# Altium project infant_temperature_1.PrjPcb
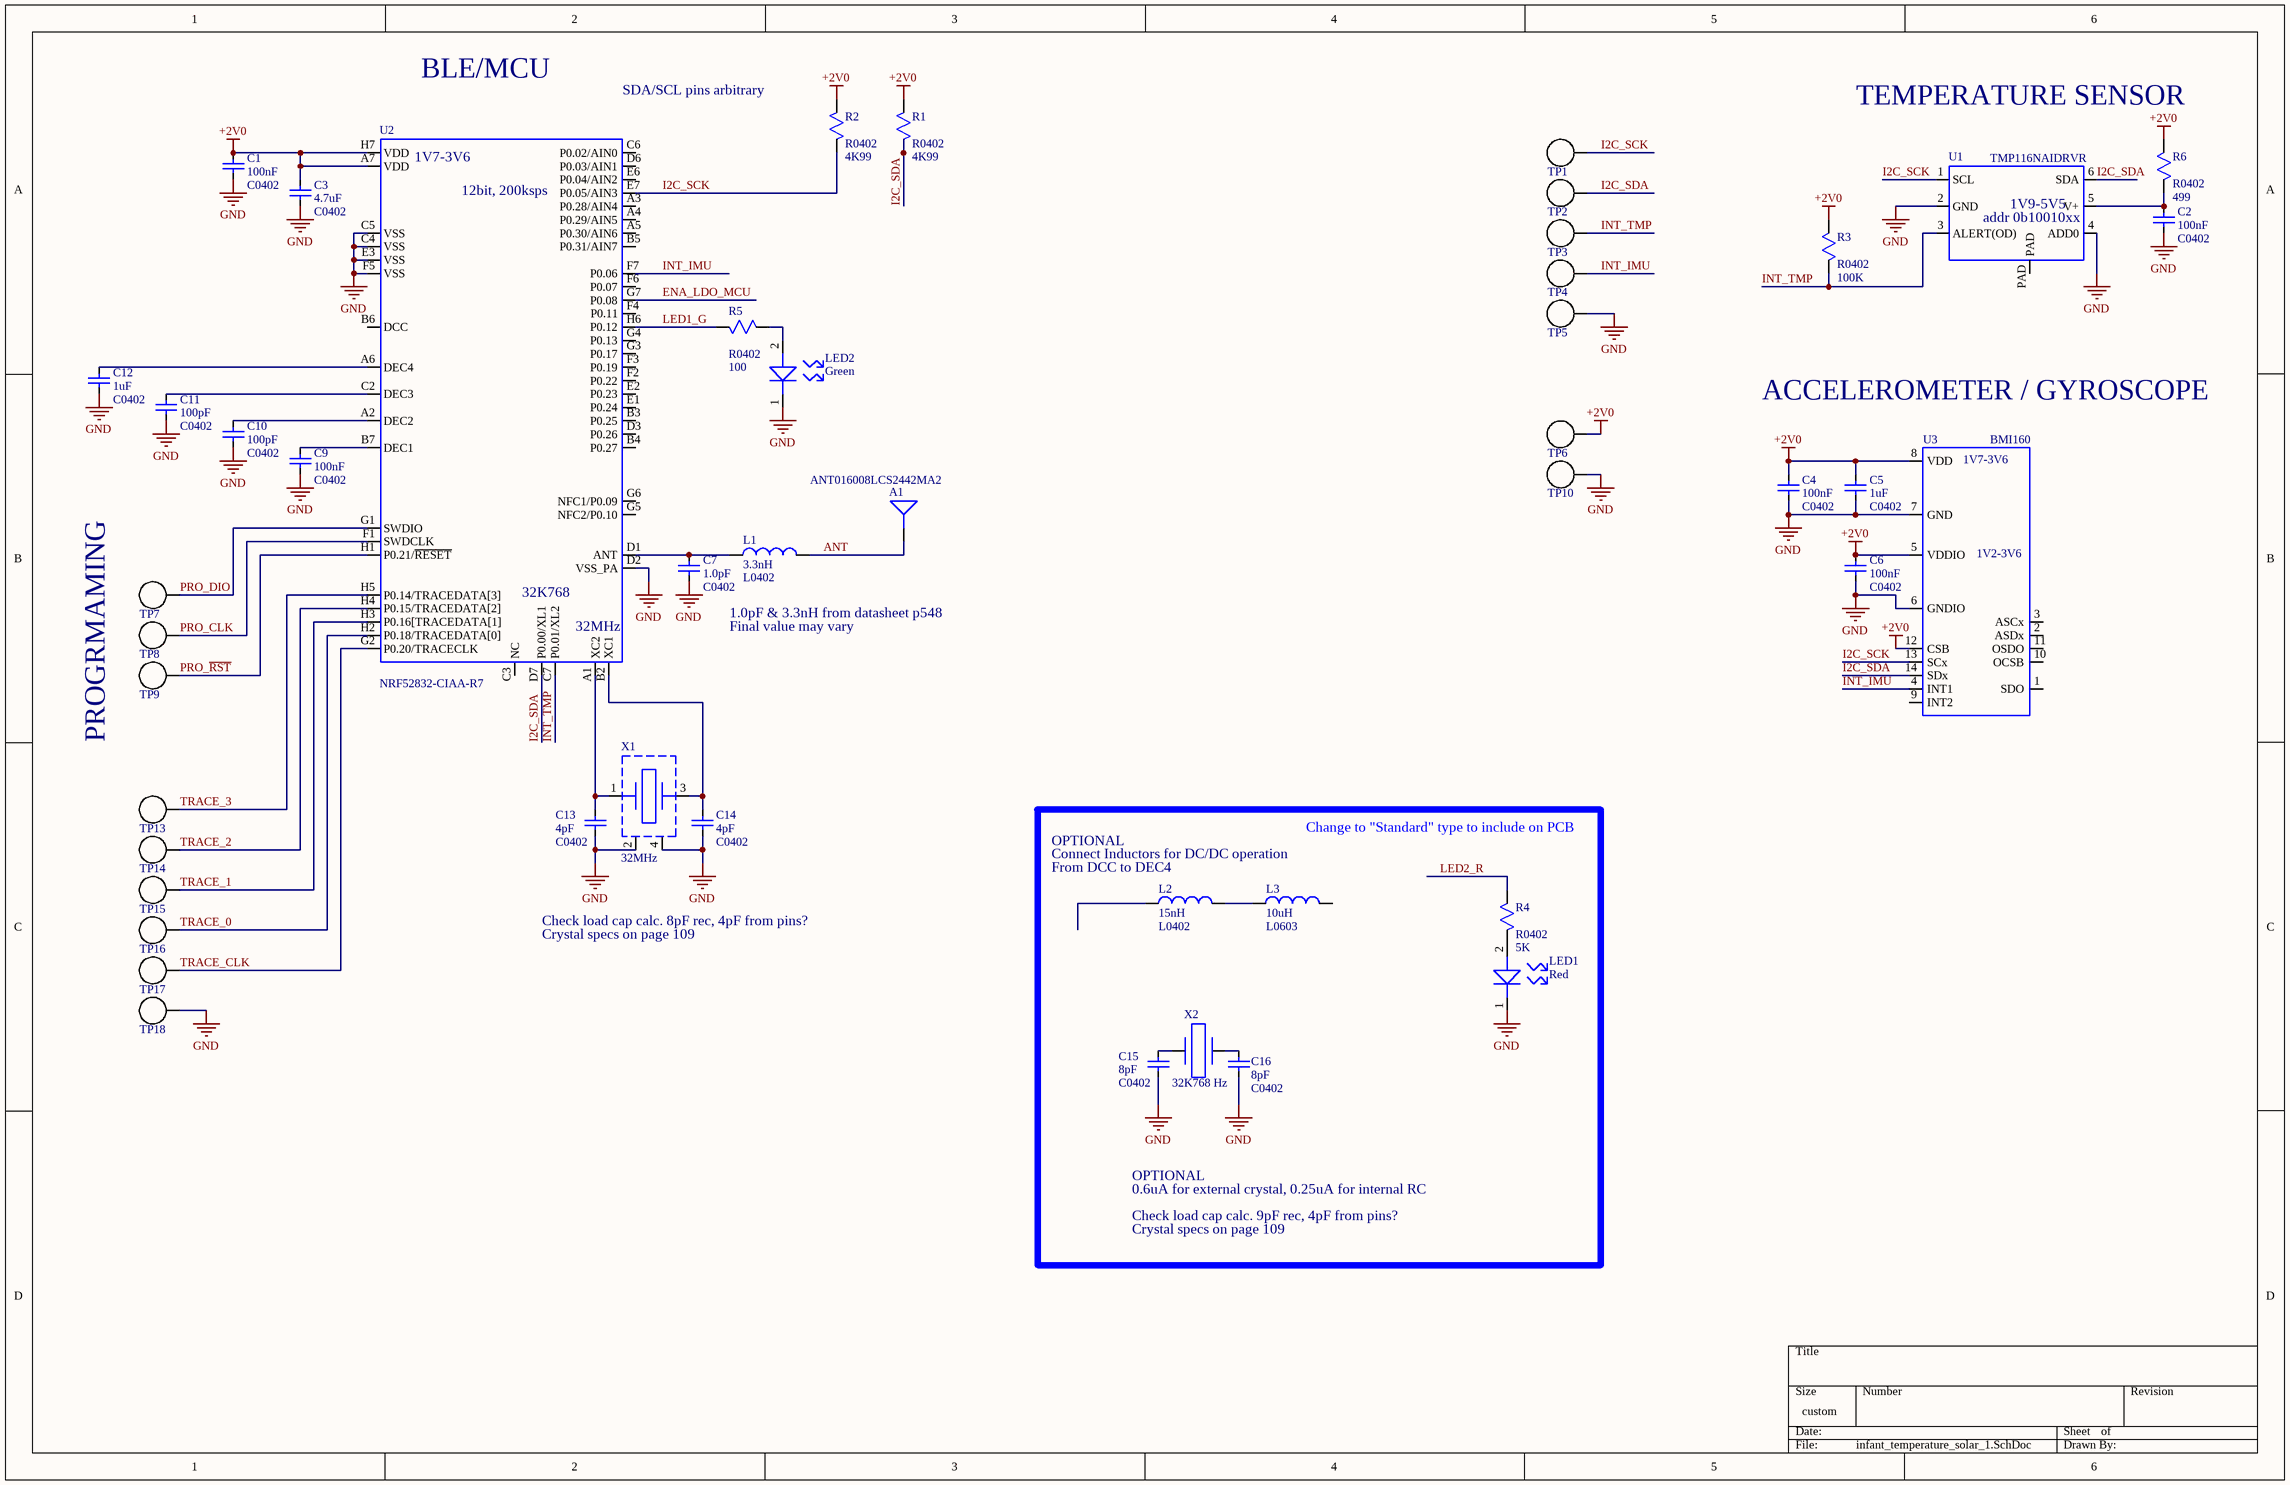
[diagram p0: infant_temperature_solar_1.SchDoc]
2 sheets, 81 parts. Net scope: global (net labels, ports and power ports of the same name join across sheets).
Board file: infant_temperature_1_solar.PcbDoc
Sheets:
  infant_temperature_solar_1.SchDoc
  infant_temperature_solar_power_1.SchDoc

## Sheet infant_temperature_solar_1.SchDoc
size 431 x 279 mm

### Parts
(Parts that share a designator on the sheet are numbered #1, #2 ... from top to bottom, then left to right.)
A1  ANT016008LCS2442MA2  [ANT016008LCS]
C1  100nF  [C0402]
C2  100nF  [C0402]
C3  4.7uF  [C0402]
C4  100nF  [C0402]
C5  1uF  [C0402]
C6  100nF  [C0402]
C7  1.0pF  [C0402]
C9  100nF  [C0402]
C10  100pF  [C0402]
C11  100pF  [C0402]
C12  1uF  [C0402]
C13  4pF  [C0402]
C14  4pF  [C0402]
C15  8pF  [C0402]  (graphical)
C16  8pF  [C0402]  (graphical)
L1  value 3.3nH  [L0402]  (hidden comment: IND)
L2  value 15nH  [L0402]  (hidden comment: IND)  (graphical)
L3  value 10uH  [L0603]  (hidden comment: IND)  (graphical)
LED1  Red  [LED_0402]  (graphical)
LED2  Green  [LED_0402]
R1  value 4K99  [R0402]  (hidden comment: Resistor)
R2  value 4K99  [R0402]  (hidden comment: Resistor)
R3  value 100K  [R0402]  (hidden comment: Resistor)
R4#1  value 5K  [R0402]  (hidden comment: Resistor)  (graphical)
R5  value 100  [R0402]  (hidden comment: Resistor)
R6  value 499  [R0402]  (hidden comment: Resistor)
TP1  Not A Part  [TP_32AWG_1X0.5MM_ROUND]  (value not drawn)  (no BOM)
TP2  Not A Part  [TP_32AWG_1X0.5MM_ROUND]  (value not drawn)  (no BOM)
TP3  Not A Part  [TP_32AWG_1X0.5MM_ROUND]  (value not drawn)  (no BOM)
TP4  Not A Part  [TP_32AWG_1X0.5MM_ROUND]  (value not drawn)  (no BOM)
TP5  Not A Part  [TP_32AWG_1X0.5MM_ROUND]  (value not drawn)  (no BOM)
TP6  Not A Part  [TP_32AWG_1X0.5MM_ROUND]  (value not drawn)  (no BOM)
TP7  Not A Part  [TP_32AWG_1X0.5MM_ROUND]  (value not drawn)  (no BOM)
TP8  Not A Part  [TP_32AWG_1X0.5MM_ROUND]  (value not drawn)  (no BOM)
TP9  Not A Part  [TP_32AWG_1X0.5MM_ROUND]  (value not drawn)  (no BOM)
TP10  Not A Part  [TP_32AWG_1X0.5MM_ROUND]  (value not drawn)  (no BOM)
TP13  Not A Part  [TP_32AWG_1X0.5MM_ROUND]  (value not drawn)  (no BOM)
TP14  Not A Part  [TP_32AWG_1X0.5MM_ROUND]  (value not drawn)  (no BOM)
TP15  Not A Part  [TP_32AWG_1X0.5MM_ROUND]  (value not drawn)  (no BOM)
TP16  Not A Part  [TP_32AWG_1X0.5MM_ROUND]  (value not drawn)  (no BOM)
TP17  Not A Part  [TP_32AWG_1X0.5MM_ROUND]  (value not drawn)  (no BOM)
TP18  Not A Part  [TP_32AWG_1X0.5MM_ROUND]  (value not drawn)  (no BOM)
U1  MfgPartNumber: TMP116NAIDRVR  [WSON-6_PAD]  (hidden comment: TMP116)
U2  MfgPartNumber: NRF52832-CIAA-R7  [XFBGA-50]  (hidden comment: NRF52832_BGA)
U3  MfgPartNumber: BMI160  [LGA-14]  (hidden comment: BMI160_ALTERNATE)
X1  32MHz  [CRYSTAL_1MM6_X_1MM2]
X2  32K768 Hz  [CRYSTAL_1MM2_X_1MM0]  (graphical)

### Nets
+2V0: C1.1 C3.1 C4.1 C5.1 C6.1 R1.1 R2.1 R3.1 R6.1 TP6.1(MTG) U2.A7(VDD) U2.H7(VDD) U3.5(VDDIO) U3.8(VDD) U3.12(CSB)
GND: C1.2 C2.2 C3.2 C4.2 C5.2 C6.2 C7.2 C9.2 C10.2 C11.2 C12.2 C13.1 C14.1 C15.1 C16.1 LED1.1 LED2.1 TP5.1(MTG) TP10.1(MTG) TP18.1(MTG) U1.2(GND) U1.4(ADD0) U2.C4(VSS) U2.C5(VSS) U2.D2(VSS_PA) U2.E3(VSS) U2.F5(VSS) U3.6(GNDIO) U3.7(GND) X1.2(GND) X1.4(GND)
ANT: A1.4(FEED) L1.2
ENA_LDO_MCU: U2.G7(P0.08)
I2C_SCK: R2.2 TP1.1(MTG) U1.1(SCL) U2.E7(P0.05/AIN3) U3.13(SCx)
I2C_SDA: R1.2 TP2.1(MTG) U1.6(SDA) U2.D7(P0.00/XL1) U3.14(SDx)
INT_IMU: TP4.1(MTG) U2.F7(P0.06) U3.4(INT1)
INT_TMP: R3.2 TP3.1(MTG) U1.3(ALERT(OD)) U2.C7(P0.01/XL2)
LED1_G: R5.1 U2.H6(P0.12)
LED2_R: R4#1.1
PRO_CLK: TP8.1(MTG) U2.F1(SWDCLK)
PRO_DIO: TP7.1(MTG) U2.G1(SWDIO)
PRO_~{RST}: TP9.1(MTG) U2.H1(P0.21/~{RESET})
TRACE_0: TP16.1(MTG) U2.H2(P0.18/TRACEDATA[0])
TRACE_1: TP15.1(MTG) U2.H3(P0.16[TRACEDATA[1])
TRACE_2: TP14.1(MTG) U2.H4(P0.15/TRACEDATA[2])
TRACE_3: TP13.1(MTG) U2.H5(P0.14/TRACEDATA[3])
TRACE_CLK: TP17.1(MTG) U2.G2(P0.20/TRACECLK)
NetC2_1: C2.1 R6.2 U1.5(V+)
NetC7_1: C7.1 L1.1 U2.D1(ANT)
NetC9_1: C9.1 U2.B7(DEC1)
NetC10_1: C10.1 U2.A2(DEC2)
NetC11_1: C11.1 U2.C2(DEC3)
NetC12_1: C12.1 U2.A6(DEC4)
NetC13_2: C13.2 U2.A1(XC2) X1.1
NetC14_2: C14.2 U2.B2(XC1) X1.3
NetC15_2: C15.2 X2.2
NetC16_2: C16.2 X2.1
NetL2_2: L2.2 L3.1
NetLED1_2: LED1.2 R4#1.2
NetLED2_2: LED2.2 R5.2

Not connected (* = marked no-connect by the designer): L2 1; L3 2; U1 PAD; U2 A3(P0.28/AIN4) A4(P0.29/AIN5) A5(P0.30/AIN6) B3(P0.25) B4(P0.27) B5(P0.31/AIN7) B6(DCC) C3(NC) C6(P0.02/AIN0) D3(P0.26) D6(P0.03/AIN1) E1(P0.24) E2(P0.23) E6(P0.04/AIN2) F2(P0.22) F3(P0.19) F4(P0.11) F6(P0.07) G3(P0.17) G4(P0.13) G5(NFC2/P0.10) G6(NFC1/P0.09); U3 1(SDO) 2(ASDx) 3(ASCx) 9(INT2) 10(OCSB) 11(OSDO)

### Notes on the sheet
- BLE/MCU
- SDA/SCL pins arbitrary
- TEMPERATURE SENSOR
- ACCELEROMETER / GYROSCOPE
- 1.0pF & 3.3nH from datasheet p548
- Final value may vary
- PROGRMAMING
- Change to "Standard" type to include on PCB
- Connect Inductors for DC/DC operation
- OPTIONAL
- (near L2) From DCC to DEC4
- Crystal specs on page 109
- Check load cap calc. 8pF rec, 4pF from pins?
- Check load cap calc. 9pF rec, 4pF from pins?
- 0.6uA for external crystal, 0.25uA for internal RC
- (in symbol BMI160_ALTERNATE) 1V7-3V6; 1V2-3V6
- (in symbol NRF52832_BGA) 1V7-3V6; 12bit, 200ksps; 32K768; 32MHz
- (in symbol TMP116) 1V9-5V5; addr 0b10010xx

### Library data of the parts
A1 = ANT016008LCS2442MA2: ANTENNA 2.4GHZ SMD; Manufacturer: TDK; DigikeyPartNumber: 445-172405CT-ND; MfgPartNumber: ANT016008LCS2442MA2
C1 C2 C4 C6 C9 = CAP: Nonpolarized capacitor; Manufacturer: Samsung; MfgPartNumber: CL05F104ZA5NNNC; VoltageRating: 25V; DigikeyPartNumber: 1276-1739-1-ND; Value: 100nF; Package: C0402
C3 = CAP: Nonpolarized capacitor; Manufacturer: Murata; MfgPartNumber: GRM155R61A475MEAAD; VoltageRating: 10V; DigikeyPartNumber: 490-14306-1-ND; Value: 4.7uF; Package: C0402
C5 C12 = CAP: Nonpolarized capacitor; Manufacturer: Taiyo Yuden; MfgPartNumber: TMK105BJ105MV-F; VoltageRating: 25V; DigikeyPartNumber: 587-3245-1-ND; Value: 1uF; Package: C0402
C7 = CAP: Nonpolarized capacitor; Manufacturer: Murata; MfgPartNumber: GRM1555C1E1R0BA01D; VoltageRating: 25V; DigikeyPartNumber: 490-11362-1-ND; Value: 1.0pF; Package: C0402
C10 C11 = CAP: Nonpolarized capacitor; Manufacturer: Yageo; MfgPartNumber: CC0402KRX7R8BB101; VoltageRating: 25V; DigikeyPartNumber: 311-3807-1-ND; Value: 100pF; Package: C0402
C13 C14 = CAP: Nonpolarized capacitor; Manufacturer: Murata; MfgPartNumber: GRM1555C1H4R0CA01D; VoltageRating: 50V; Value: 4pF; Package: C0402; ClassName: MCU; DigikeyPartNumber: 490-5873-1-ND
C15 C16 = CAP: Nonpolarized capacitor; Manufacturer: Lookup; VoltageRating: 10V; Value: 8pF; Package: C0402; ClassName: MCU; DigikeyPartNumber: Lookup; MfgPartNumber: Lookup
L1 = IND: Inductor; Manufacturer: Murata; MfgPartNumber: LQW15AN3N3B80D; DigikeyPartNumber: 490-7641-1-ND; Package: L0402
L2 L3 = IND: Inductor; Manufacturer: Lookup; MfgPartNumber: Lookup; DigikeyPartNumber: Lookup
  L2: Package: L0402
  L3: Package: L0603
LED1 = LED: Manufacturer: Lookup; Package: LED_0402; MfgPartNumber: Lookup; DigikeyPartNumber: Lookup; Color: Red
LED2 = LED: Manufacturer: Kingbright; MfgPartNumber: APHHS1005LCGCK; Package: LED_0402; DigikeyPartNumber: 754-2121-1-ND; Color: Green
R1 R2 = RES: Manufacturer: Panasonic; MfgPartNumber: ERJ-2RKF4991X; Tolerance: 1%; DigikeyPartNumber: P4.99KLCT-ND
R3 = RES: Manufacturer: Yageo; MfgPartNumber: RT0402FRE07100KL; Tolerance: 1%; DigikeyPartNumber: YAG2307CT-ND
R4#1 = RES: Manufacturer: Lookup; Tolerance: 1%; MfgPartNumber: Lookup; DigikeyPartNumber: Lookup
R5 = RES: Manufacturer: Yageo; MfgPartNumber: RC0100FR-07100RL; Tolerance: 1%; DigikeyPartNumber: 311-100DGCT-ND
R6 = RES: Manufacturer: Panasonic; MfgPartNumber: ERJ-2RKF4990X; Tolerance: 1%; DigikeyPartNumber: P499LCT-ND
TP1-TP10 TP13-TP18 = TP_32AWG: 0.305mm (12mil) hole for 32AWG wire. No BOM item.
U1 = TMP116: Temperature Sensor Digital, Local -55°C ~ 125°C 16 b 6-WSON (2x2); Manufacturer: Texas Instruments; DigikeyPartNumber: 296-48306-1-ND
U2 = NRF52832_BGA: Bluetooth Low Energy 50-XFBGA; Manufacturer: Nordic Semiconductor ASA; DigikeyPartNumber: 1490-1066-1-ND
U3 = BMI160_ALTERNATE: IMU ACCEL/GYRO I2C/SPI 14LGA; Manufacturer: Bosch; DigikeyPartNumber: 828-1057-1-ND
X1 = CRYSTAL_32MHz: CRYSTAL 32.0000MHZ 8PF SMD; Manufacturer: Diodes Inc.; MfgPartNumber: US3200005Z; DigikeyPartNumber: US3200005ZCT-ND; Package: CRYSTAL_1MM6_X_1MM2
X2 = CRYSTAL_32K768_1MM2_X_1MM0: 32.768kHz ±20ppm Crystal 9pF 90 kOhms 2-SMD, No Lead; Manufacturer: ECS Inc.; MfgPartNumber: ECS-.327-9-1210-TR; DigikeyPartNumber: XC2283CT-ND; Package: CRYSTAL_1MM2_X_1MM0

## Sheet infant_temperature_solar_power_1.SchDoc
size 431 x 279 mm
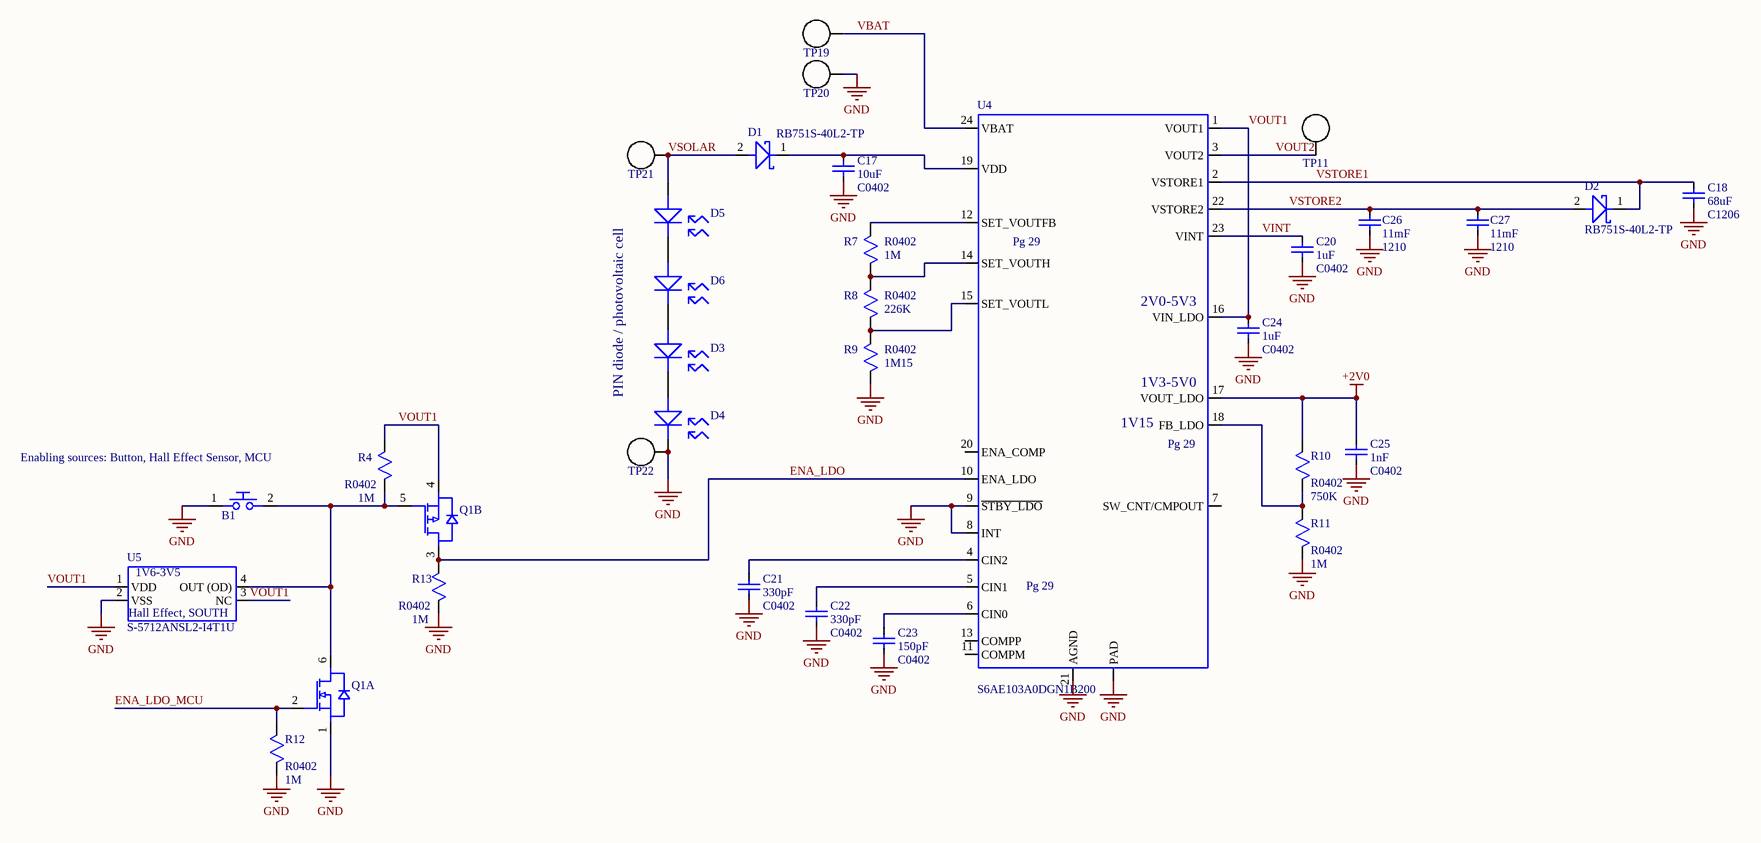
[diagram p1: infant_temperature_solar_power_1.SchDoc]

### Parts
(Parts that share a designator on the sheet are numbered #1, #2 ... from top to bottom, then left to right.)
B1  KXT331LHS  [KXT3_button]  (value not drawn)
C17  10uF  [C0402]
C18  68uF  [C1206]
C20  1uF  [C0402]
C21  330pF  [C0402]
C22  330pF  [C0402]
C23  150pF  [C0402]
C24  1uF  [C0402]
C25  1nF  [C0402]
C26  value 11mF  Package: 1210  [CPH3225A-2K]  (hidden comment: CPH3225A-2K)
C27  value 11mF  Package: 1210  [CPH3225A-2K]  (hidden comment: CPH3225A-2K)
D1  RB751S-40L2-TP  [D0402]
D2  RB751S-40L2-TP  [D0402]
D3  VEMD5060X01  [VEMD5060X01]  (value not drawn)
D4  VEMD5060X01  [VEMD5060X01]  (value not drawn)
D5  VEMD5060X01  [VEMD5060X01]  (value not drawn)
D6  VEMD5060X01  [VEMD5060X01]  (value not drawn)
Q1  dual fet SSMini6  [SSMini6-F3-B]  (value not drawn)  (parts A,B of 2)
R4#2  1M  [R0402]
R7  1M  [R0402]
R8  226K  [R0402]
R9  1M15  [R0402]
R10  750K  [R0402]
R11  1M  [R0402]
R12  1M  [R0402]
R13  1M  [R0402]
TP11  Not A Part  [TP_32AWG_1X0.5MM_ROUND]  (value not drawn)  (no BOM)
TP19  Not A Part  [TP_32AWG_1X0.5MM_ROUND]  (value not drawn)  (no BOM)
TP20  Not A Part  [TP_32AWG_1X0.5MM_ROUND]  (value not drawn)  (no BOM)
TP21  Not A Part  [TP_32AWG_1X0.5MM_ROUND]  (value not drawn)  (no BOM)
TP22  Not A Part  [TP_32AWG_1X0.5MM_ROUND]  (value not drawn)  (no BOM)
U4  MfgPartNumber: S6AE103A0DGN1B200  [VQFN-24_PAD]  (hidden comment: S6AE103A)
U5  S-5712ANSL2-I4T1U  [SNT-4A]

### Nets
+2V0: C25.1 R10.2 U4.17(VOUT_LDO)
GND: B1.1 C17.2 C18.2 C20.2 C21.2 C22.2 C23.2 C24.2 C25.2 C26.1 C27.1 D4.C Q1.1(S) R9.1 R11.1 R12.1 R13.1 TP20.1(MTG) TP22.1(MTG) U4.8(INT) U4.9(~{STBY_LDO}) U4.21(AGND) U4.PAD U5.2(VSS)
ENA_LDO: Q1.3(D) R13.2 U4.10(ENA_LDO)
ENA_LDO_MCU: Q1.2(G) R12.2
VBAT: TP19.1(MTG) U4.24(VBAT)
VINT: C20.1 U4.23(VINT)
VOUT1: C24.1 Q1.4(S) R4#2.2 U4.1(VOUT1) U4.16(VIN_LDO) U5.1(VDD) U5.3(NC)
VOUT2: TP11.1(MTG) U4.3(VOUT2)
VSOLAR: D1.2 D5.A TP21.1(MTG)
VSTORE1: C18.1 D2.1 U4.2(VSTORE1)
VSTORE2: C26.2 C27.2 D2.2 U4.22(VSTORE2)
NetB1_2: B1.2 Q1.5(G) Q1.6(D) R4#2.1 U5.4(OUT_(OD))
NetC17_1: C17.1 D1.1 U4.19(VDD)
NetC21_1: C21.1 U4.4(CIN2)
NetC22_1: C22.1 U4.5(CIN1)
NetC23_1: C23.1 U4.6(CIN0)
NetD3_A: D3.A D6.C
NetD3_C: D3.C D4.A
NetD5_C: D5.C D6.A
NetR7_1: R7.1 R8.2 U4.14(SET_VOUTH)
NetR7_2: R7.2 U4.12(SET_VOUTFB)
NetR8_1: R8.1 R9.2 U4.15(SET_VOUTL)
NetR10_1: R10.1 R11.2 U4.18(FB_LDO)

Not connected (* = marked no-connect by the designer): U4 7(SW_CNT/CMPOUT) 11(COMPM) 13(COMPP) 20(ENA_COMP)

### Notes on the sheet
- PIN diode / photovoltaic cell
- (near B1) Enabling sources: Button, Hall Effect Sensor, MCU
- (in symbol S6AE103A) Pg 29; 2V0-5V3; 1V3-5V0; 1V15
- (in symbol S-5712ANSL2-I4T1U) 1V6-3V5; Hall Effect, SOUTH

### Library data of the parts
B1 = KXT3_button: SWITCH TACTILE SPST-NO 0.02A 15V; Manufacturer: C&K; DigikeyPartNumber: CKN10779CT-ND; MfgPartNumber: KXT331LHS
C17 = CAP: Nonpolarized capacitor; Manufacturer: Murata; MfgPartNumber: GRJ155R60J106ME11D; VoltageRating: 6.3V; DigikeyPartNumber: 490-13211-1-ND; Value: 10uF; Package: C0402
C18 = CAP: Nonpolarized capacitor; Manufacturer: TDK Corporation; MfgPartNumber: C3216JB1A686M160AC; VoltageRating: 10V; DigikeyPartNumber: 445-11687-1-ND; Value: 68uF; Package: C1206
C20 C24 = CAP: as C5 on sheet infant_temperature_solar_1; DigikeyPartNumber: 587-3245-1-ND; Value: 1uF; Package: C0402
C21 C22 = CAP: Nonpolarized capacitor; Manufacturer: KEMET; MfgPartNumber: C0402C331J3GAC7867; VoltageRating: 25V; DigikeyPartNumber: 399-15320-1-ND; Value: 330pF; Package: C0402
C23 = CAP: Nonpolarized capacitor; Manufacturer: Murata; MfgPartNumber: GRM1555C1E151JA01D; VoltageRating: 25V; DigikeyPartNumber: 490-6171-1-ND; Value: 150pF; Package: C0402
C25 = CAP: Nonpolarized capacitor; Manufacturer: Yageo; MfgPartNumber: CC0402KRX7R8BB102; VoltageRating: 25V; DigikeyPartNumber: 311-1712-1-ND; Value: 1nF; Package: C0402
C26 C27 = CPH3225A-2K: 11mF (EDLC) Supercapacitor 3.3V 1210 (3225 Metric); Manufacturer: Seiko Instruments; DigikeyPartNumber: 728-1067-1-ND; MfgPartNumber: CPH3225A-2K; VoltageRating: 3.3V
D1 D2 = RB751S: Diode Schottky 40V 30mA Surface Mount DFN1006-2; Manufacturer: Micro Commercial Co; MfgPartNumber: RB751S-40L2-TP; DigikeyPartNumber: RB751S-40L2-TPMSCT-ND
D3-D6 = VEMD5060X01: PHOTODIODE PIN 820NM SMD; Manufacturer: Vishay; DigikeyPartNumber: VEMD5060X01CT-ND; MfgPartNumber: VEMD5060X01
Q1 = FG6943010R: MOSFET N/P-CH 30V 0.1A SSMINI6; Manufacturer: Panasonic Electronic Components; MfgPartNumber: FG6943010R; DigikeyPartNumber: FG6943010RCT-ND
R4#2 R7 R11-R13 = RES: Resistor; Manufacturer: Yageo; MfgPartNumber: RC0402FR-071ML; Tolerance: 1%; DigikeyPartNumber: 311-1.00MLRCT-ND; Value: 1M
R8 = RES: Resistor; Manufacturer: Yageo; MfgPartNumber: RC0402FR-07226KL; Tolerance: 1%; DigikeyPartNumber: 311-226KLRCT-ND; Value: 226K
R9 = RES: Resistor; Manufacturer: Vishay Dale; MfgPartNumber: CRCW04021M15FKED; Tolerance: 1%; DigikeyPartNumber: 541-1.15MLCT-ND; Value: 1M15
R10 = RES: Resistor; Manufacturer: Yageo; MfgPartNumber: AC0402FR-07750KL; Tolerance: 1%; DigikeyPartNumber: YAG5686CT-ND; Value: 750K
TP11 TP19-TP22 = TP_32AWG: as TP1 on sheet infant_temperature_solar_1
U4 = S6AE103A: IC PMIC ENERGY HARVESTING 24QFN; Manufacturer: Cypress; DigikeyPartNumber: 428-3873-1-ND
U5 = S-5712ANSL2-I4T1U: Digital Switch Unipolar Switch Open Drain Hall Effect SNT-4A; Manufacturer: ABLIC; DigikeyPartNumber: 1662-1617-1-ND; MfgPartNumber: S-5712ANSL2-I4T1U

## Nets that join several sheets
+2V0: infant_temperature_solar_1 (15 pins), infant_temperature_solar_power_1 (C25.1 R10.2 U4.17)
GND: infant_temperature_solar_1 (31 pins), infant_temperature_solar_power_1 (24 pins)
ENA_LDO_MCU: infant_temperature_solar_1 (U2.G7), infant_temperature_solar_power_1 (Q1.2 R12.2)